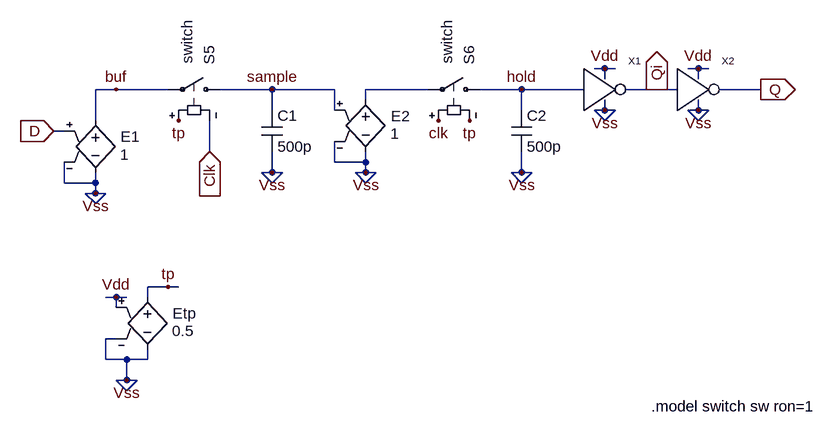
[diagram p0: schematic dff1.asc]
dff1.asc, the LTspice schematic file:
Version 4
SHEET 1 6308 700
WIRE 1472 -736 1456 -736
WIRE 1488 -736 1472 -736
WIRE 1616 -736 1600 -736
WIRE 1632 -736 1616 -736
WIRE 1472 -720 1472 -736
WIRE 1616 -720 1616 -736
WIRE 720 -704 688 -704
WIRE 800 -704 720 -704
WIRE 960 -704 880 -704
WIRE 1056 -704 960 -704
WIRE 1200 -704 1104 -704
WIRE 1344 -704 1280 -704
WIRE 1440 -704 1344 -704
WIRE 1552 -704 1504 -704
WIRE 1584 -704 1552 -704
WIRE 1712 -704 1648 -704
WIRE 1104 -688 1104 -704
WIRE 960 -672 960 -704
WIRE 1056 -672 1056 -704
WIRE 1344 -672 1344 -704
WIRE 1472 -672 1472 -688
WIRE 1472 -672 1456 -672
WIRE 1488 -672 1472 -672
WIRE 1616 -672 1616 -688
WIRE 1616 -672 1600 -672
WIRE 1632 -672 1616 -672
WIRE 688 -656 688 -704
WIRE 1472 -656 1456 -672
WIRE 1472 -656 1488 -672
WIRE 1616 -656 1600 -672
WIRE 1616 -656 1632 -672
WIRE 640 -640 624 -640
WIRE 864 -608 864 -656
WIRE 1056 -592 1056 -624
WIRE 1104 -592 1104 -608
WIRE 1104 -592 1056 -592
WIRE 960 -576 960 -608
WIRE 960 -576 944 -576
WIRE 976 -576 960 -576
WIRE 1104 -576 1104 -592
WIRE 1104 -576 1088 -576
WIRE 1120 -576 1104 -576
WIRE 1344 -576 1344 -608
WIRE 1344 -576 1328 -576
WIRE 1360 -576 1344 -576
WIRE 640 -560 640 -592
WIRE 688 -560 688 -576
WIRE 688 -560 640 -560
WIRE 960 -560 944 -576
WIRE 960 -560 976 -576
WIRE 1104 -560 1088 -576
WIRE 1104 -560 1120 -576
WIRE 1344 -560 1328 -576
WIRE 1344 -560 1360 -576
WIRE 688 -544 688 -560
WIRE 688 -544 672 -544
WIRE 704 -544 688 -544
WIRE 688 -528 672 -544
WIRE 688 -528 704 -544
WIRE 800 -400 768 -400
WIRE 816 -400 800 -400
WIRE 720 -384 704 -384
WIRE 736 -384 720 -384
WIRE 768 -384 768 -400
WIRE 720 -368 720 -384
WIRE 720 -320 704 -320
WIRE 704 -288 704 -320
WIRE 736 -288 704 -288
WIRE 768 -288 768 -304
WIRE 768 -288 736 -288
WIRE 736 -256 736 -288
WIRE 736 -256 720 -256
WIRE 752 -256 736 -256
WIRE 736 -240 720 -256
WIRE 736 -240 752 -256
FLAG 624 -640 D
IOPIN 624 -640 In
FLAG 1712 -704 Q
IOPIN 1712 -704 Out
FLAG 864 -608 Clk
IOPIN 864 -608 In
FLAG 1344 -704 hold
FLAG 720 -384 Vdd
FLAG 1552 -704 Qi
IOPIN 1552 -704 Out
FLAG 736 -256 Vss
FLAG 688 -544 Vss
FLAG 800 -400 tp
FLAG 960 -576 Vss
FLAG 1344 -576 Vss
FLAG 816 -656 tp
FLAG 1264 -656 tp
FLAG 1216 -656 clk
FLAG 720 -704 buf
FLAG 960 -704 sample
FLAG 1104 -576 Vss
FLAG 1472 -736 Vdd
FLAG 1472 -672 Vss
FLAG 1616 -736 Vdd
FLAG 1616 -672 Vss
SYMBOL e 768 -400 R0
WINDOW 0 39 41 Left 0
WINDOW 3 38 68 Left 0
SYMATTR InstName Etp
SYMATTR Value 0.5
SYMBOL e 688 -672 R0
WINDOW 0 39 41 Left 0
WINDOW 3 38 68 Left 0
SYMATTR InstName E1
SYMATTR Value 1
SYMBOL cap 944 -672 R0
SYMATTR InstName C1
SYMATTR Value 500p
SYMBOL sw 896 -704 M270
WINDOW 3 24 -12 Left 0
WINDOW 38 39 67 Left 0
WINDOW 0 38 33 Left 0
SYMATTR Value ""
SYMATTR SpiceModel switch
SYMATTR InstName S5
SYMBOL sw 1296 -704 M270
WINDOW 3 24 -12 Left 0
WINDOW 38 39 67 Left 0
WINDOW 0 38 33 Left 0
SYMATTR Value ""
SYMATTR SpiceModel switch
SYMATTR InstName S6
SYMBOL cap 1328 -672 R0
SYMATTR InstName C2
SYMATTR Value 500p
SYMBOL e 1104 -704 R0
WINDOW 0 39 41 Left 0
WINDOW 3 38 68 Left 0
SYMATTR InstName E2
SYMATTR Value 1
SYMBOL inv 1440 -672 R0
SYMATTR InstName X1
SYMBOL inv 1584 -672 R0
SYMATTR InstName X2
TEXT 1544 -216 Left 0 !.model switch sw ron=1

The netlist it stands for:
* dff1.asc
Etp tp Vss Vdd Vss 0.5
E1 buf Vss D Vss 1
C1 sample Vss 500p
S5 sample buf tp Clk switch
S6 hold N001 Clk tp switch
C2 hold Vss 500p
E2 N001 Vss sample Vss 1
XX1 Vdd Vss hold Qi inv  ; pins Vdd Vss IN OUT
XX2 Vdd Vss Qi Q inv  ; pins Vdd Vss IN OUT
.model switch sw ron=1
.backanno
.end